# Altium schematic sheet OSSI-1 Beacon_1.SchDoc: TITLE:
size 410 x 286 mm; Date: Date:; >LAST_DATE_TIME: 01/11/2015 13:17:35; Sheet:: Sheet:; >SHEET: 2; REV:: REV:; Document Number:: Document Number:; >DRAWING_NAME: OSSI-1 Beacon.sch
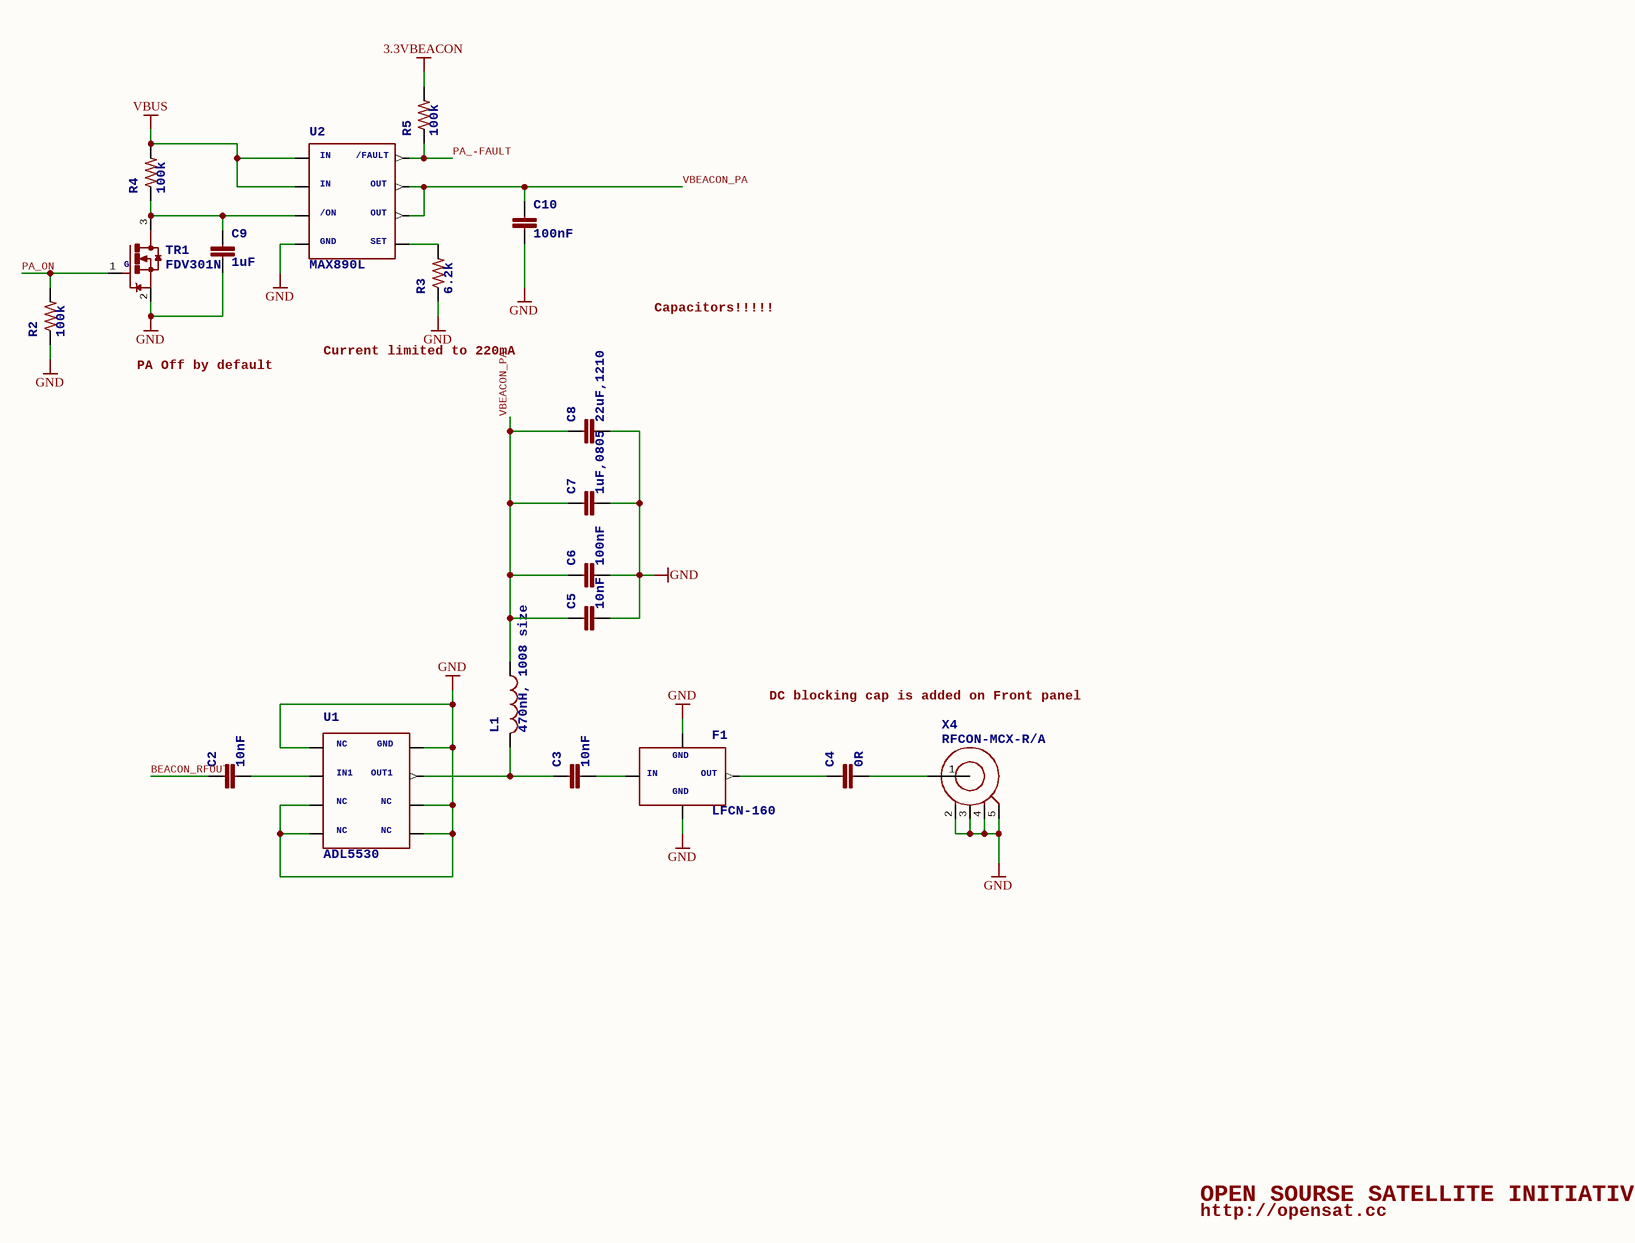
[diagram p0: OSSI-1 Beacon_1.SchDoc]

## Parts
C2  >NAME: C2  [C0603(1608)]  (hidden comment: 10nF)
C3  >NAME: C3  [C0603(1608)]  (hidden comment: 10nF)
C4  >NAME: C4  [C0603(1608)]  (hidden comment: 0R)
C5  >NAME: C5  [C0603(1608)]  (hidden comment: 10nF)
C6  >NAME: C6  [C0603(1608)]  (hidden comment: 100nF)
C7  >NAME: C7  [C0805(2012)]  (hidden comment: 1uF,0805)
C8  >NAME: C8  [C1210-GCM32]  (hidden comment: 22uF,1210)
C9  >NAME: C9  [C0603(1608)]  (hidden comment: 1uF)
C10  >NAME: C10  [C0603(1608)]  (hidden comment: 100nF)
F1  >NAME: F1  [LFCN]  (hidden comment: LFCN-160)
L1  >NAME: L1  [L1008(2520)]  (hidden comment: 470nH, 1008 size)
R2  >NAME: R2  [R0603(1608)]  (hidden comment: 100k)
R3  >NAME: R3  [R0603(1608)]  (hidden comment: 6.2k)
R4  >NAME: R4  [R0603(1608)]  (hidden comment: 100k)
R5  >NAME: R5  [R0603(1608)]  (hidden comment: 100k)
TR1  >NAME: TR1  [SOT23]  (hidden comment: FDV301N)
U1  >NAME: U1  [LFCSP8_CP]  (hidden comment: ADL5530)
U2  >NAME: U2  [SO8]  (hidden comment: MAX890L)
X4  >NAME: X4  [MCX-R/A]  (hidden comment: RFCON-MCX-R/A)

## Nets
3.3VBEACON: R5.2
GND: C5.2 C6.2 C7.2 C8.P$2 C9.2 C10.2 F1.2(P$2) F1.4(P$4) R2.1 R3.1 TR1.2(S) U1.1 U1.3 U1.4 U1.5 U1.6 U1.8 U2.4(P$4) X4.2 X4.3 X4.4 X4.5
VBUS: R4.2 U2.1(P$1) U2.2(P$2)
BEACON_RFOUT: C2.1
PA_-FAULT: R5.1 U2.8(P$8)
PA_ON: R2.2 TR1.1(G)
VBEACON_PA: C5.1 C6.1 C7.1 C8.P$1 C10.1 L1.P$1 U2.6(P$6) U2.7(P$7)
NetC2_2: C2.2 U1.2
NetC3_1: C3.1 L1.P$2 U1.7
NetC3_2: C3.2 F1.1(P$1)
NetC4_1: C4.1 F1.3(P$3)
NetC4_2: C4.2 X4.1
NetC9_1: C9.1 R4.1 TR1.3(D) U2.3(P$3)
NetR3_2: R3.2 U2.5(P$5)

## Notes on the sheet
- PA Off by default
- Current limited to 220mA
- Capacitors!!!!!
- DC blocking cap is added on Front panel
- OPEN SOURSE SATELLITE INITIATIVE
- http://opensat.cc

## Library data of the parts
C2-C6 C9 C10 = C0603(1608)
  C2 C3 C5: >VALUE: 10nF
  C4: >VALUE: 0R
  C6 C10: >VALUE: 100nF
  C9: >VALUE: 1uF
C7 = C0805(2012): >VALUE: 1uF,0805
C8 = C1210(3225)-GCM32: >VALUE: 22uF,1210
F1 = LFCN-160: <b>LFCN-160 Low Pass Filter</b> / <ul> / <li>DC - 160MHz Low Pass Filter</li> / <li>Cut Off Freq: 230MHz</li> / <li>8W power rating ( degraded to 3W at 100 celcius degree)</li> / </ul>; IN: IN; OUT: OUT; GND: GND; >VALUE: LFCN-160
L1 = L1008(2502): >VALUE: 470nH, 1008 size
R2-R5 = R0603(1608)
  R2 R4 R5: >VALUE: 100k
  R3: >VALUE: 6.2k
TR1 = FDV301N: FDV301N Digital N channel - FET / Rdson = 5 Ohm / Vgs = 0.7~1.06V / Ids = 220mA; G: G; >VALUE: FDV301N
U1 = ADL5530: <b>ADL5530</b> / <ul> / <li>IF Gain Block</li> / <li>Fixed gain: 16.dB</li> / <li>Operation: 0~1000Mhz</li> / <li>Internally matched input and output to 50 Ω</li> / <li>Power supply: 3V or 5V</li> / <li>110 mA power supply current</li> / </ul>; >VALUE: ADL5530; NC: NC; IN1: IN1; GND: GND; OUT1: OUT1
U2 = MAX890L: <B>MAX 890L</B> / <BR /> / 1.2A, Current-Limited, High-Side / P-Channel Switch with Thermal Shutdown BY MAXIM; IN: IN; /ON: /ON; GND: GND; SET: SET; OUT: OUT; /FAULT: /FAULT; >VALUE: MAX890L
X4 = RFCON-MCX-R/A: RF Connectors; >VALUE: RFCON-MCX-R/A